# Altium schematic sheet chargeCap.SchDoc
size A4
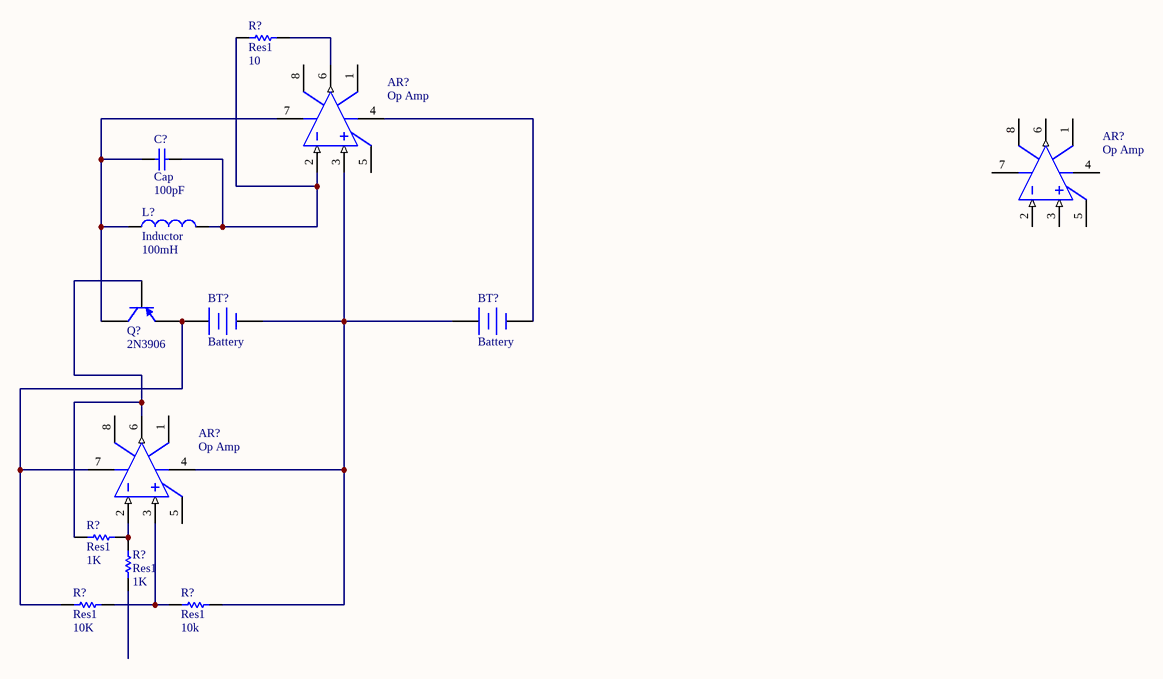
[diagram p0: chargeCap.SchDoc]

## Parts
(Parts that share a designator on the sheet are numbered #1, #2 ... from top to bottom, then left to right.)
AR?#1  Op Amp  [H-08A]
AR?#2  Op Amp  [H-08A]
AR?#3  Op Amp  [H-08A]
BT?#1  Battery  [BAT-2]
BT?#2  Battery  [BAT-2]
C?  Cap  value 100pF  [RAD-0.3]
L?  Inductor  value 100mH  [0402-A]
Q?  2N3906  [TO-92A]
R?#1  Res1  value 10  [AXIAL-0.3]
R?#2  Res1  value 1K  [AXIAL-0.3]
R?#3  Res1  value 1K  [AXIAL-0.3]
R?#4  Res1  value 10K  [AXIAL-0.3]
R?#5  Res1  value 10k  [AXIAL-0.3]

## Nets
NetAR?#1_2: AR?#1.2(IN-) C?.2 L?.2 R?#1.1
NetAR?#1_3: AR?#1.3(IN+) AR?#3.4(V-) BT?#1.2(-) BT?#2.1(+) R?#5.2
NetAR?#1_4: AR?#1.4(V-) BT?#2.2(-)
NetAR?#1_6: AR?#1.6(OUT) R?#1.2
NetAR?#1_7: AR?#1.7(V+) C?.1 L?.1 Q?.3(C)
NetAR?#3_2: AR?#3.2(IN-) R?#2.1 R?#3.1
NetAR?#3_3: AR?#3.3(IN+) R?#4.2 R?#5.1
NetAR?#3_6: AR?#3.6(OUT) Q?.2(B) R?#2.2
NetAR?#3_7: AR?#3.7(V+) BT?#1.1(+) Q?.1(E) R?#4.1

Not connected (* = marked no-connect by the designer): AR?#1 1(OS_NUL) 5(OS_NUL) 8(TAB); AR?#2 1(OS_NUL) 2(IN-) 3(IN+) 4(V-) 5(OS_NUL) 6(OUT) 7(V+) 8(TAB); AR?#3 1(OS_NUL) 5(OS_NUL) 8(TAB); R?#3 2

## Library data of the parts
AR?#1-AR?#3 = Op Amp: FET Operational Amplifier; Published: 8-Jun-2000; LatestRevisionDate: 17-Jul-2002; LatestRevisionNote: Re-released for DXP Platform.; DatasheetVersion: REV. B; PackageVersion: 1990; PackageReference: H-08A; Publisher: Altium Limited; PackageDescription: Can; 8 Leads; Pin Circle Dia. 5.08 mm; Lead Dia. 0.53 mm (max); ComponentLink1Description: Manufacturer Link; ComponentLink1URL: http://www.analog.com/
BT?#1 BT?#2 = Battery: Multicell Battery; Published: 24-Mar-1999; LatestRevisionDate: 17-Jul-2002; LatestRevisionNote: Re-released for DXP Platform.; PackageReference: BAT-2; Publisher: Altium Limited; PackageDescription: Battery; 2 Leads
C? = Cap: Capacitor; Published: 8-Jun-2000; LatestRevisionDate: 17-Jul-2002; LatestRevisionNote: Re-released for DXP Platform.; PackageReference: RAD-0.3; Publisher: Altium Limited; PackageDescription: Radial Cap, Thru-Hole; 2 Leads; 0.3 in Pin Spacing
L? = Inductor: Code_IEC: 1005; Published: 8-Jun-2000; LatestRevisionDate: 29-May-2009; LatestRevisionNote: IPC-7351 Footprint Added.; PackageReference: 0402-A; Publisher: Altium Limited; PackageDescription: Chip Inductor; Code_JEITA: 0402
Q? = 2N3906: PNP General Purpose Amplifier; Published: 8-Jun-2000; LatestRevisionDate: 15-Jan-2003; LatestRevisionNote: PCB Footprint 'BCY-W3/D4.7' replaced; DatasheetVersion: 1997; PackageVersion: Sep-1998; PackageReference: TO-92A; Publisher: Altium Limited; PackageDescription: TO, Flat Index; 3 In-Line, Axial Leads; Body Dia. 4.5mm; Leads 0.51 x 0.48 mm (max); ComponentLink1Description: Manufacturer Link; ComponentLink1URL: http://www.fairchildsemi.com/; ComponentLink2Description: Datasheet; ComponentLink2URL: http://www.fairchildsemi.com/ds/2N%2F2N3906.pdf
R?#1-R?#5 = Res1: Resistor; Published: 8-Jun-2000; LatestRevisionDate: 17-Jul-2002; LatestRevisionNote: Re-released for DXP Platform.; PackageReference: AXIAL-0.3; Publisher: Altium Limited; PackageDescription: Axial Device, Thru-Hole; 2 Leads; 0.3 in Pin Spacing